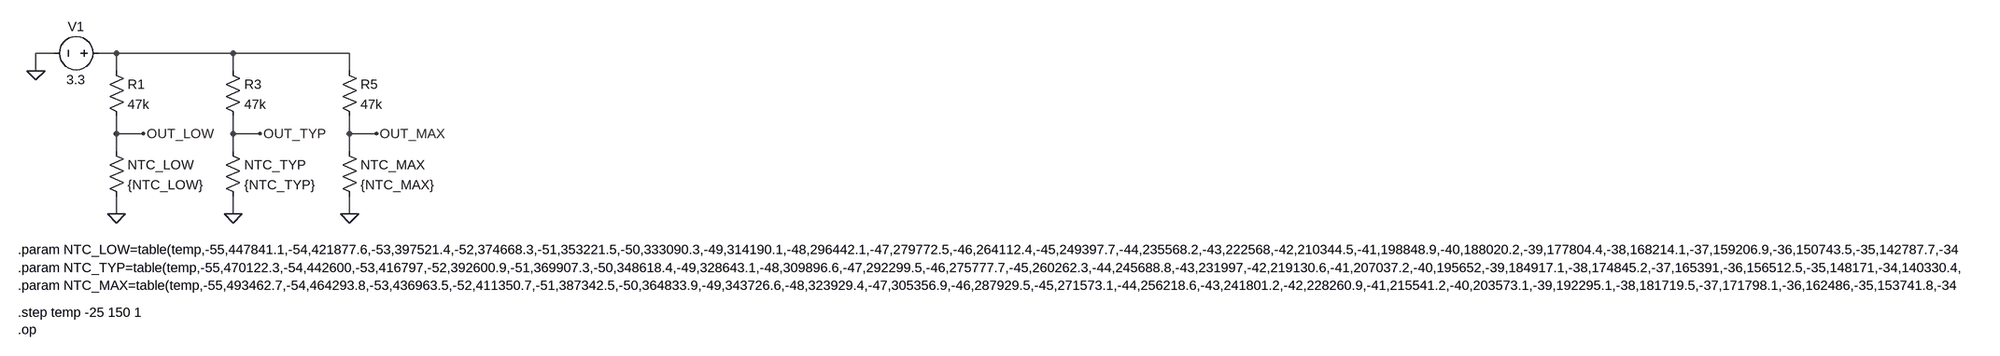
[diagram p0: schematic NTC.asc]
NTC.asc, the LTspice schematic file:
Version 4
SHEET 1 37652 680
WIRE 0 32 -32 32
WIRE 112 32 80 32
WIRE 320 32 112 32
WIRE 528 32 320 32
WIRE -32 64 -32 32
WIRE 112 64 112 32
WIRE 320 64 320 32
WIRE 528 64 528 32
WIRE 112 176 112 144
WIRE 160 176 112 176
WIRE 320 176 320 144
WIRE 368 176 320 176
WIRE 528 176 528 144
WIRE 576 176 528 176
WIRE 112 208 112 176
WIRE 320 208 320 176
WIRE 528 208 528 176
WIRE 112 320 112 288
WIRE 320 320 320 288
WIRE 528 320 528 288
FLAG 112 320 0
FLAG -32 64 0
FLAG 160 176 OUT_LOW
FLAG 320 320 0
FLAG 368 176 OUT_TYP
FLAG 528 320 0
FLAG 576 176 OUT_MAX
SYMBOL res 96 48 R0
SYMATTR InstName R1
SYMATTR Value 47k
SYMBOL res 96 192 R0
SYMATTR InstName NTC_LOW
SYMATTR Value {NTC_LOW}
SYMBOL voltage 96 32 R90
WINDOW 0 -32 56 VBottom 2
WINDOW 3 32 56 VTop 2
WINDOW 123 0 0 Left 0
WINDOW 39 0 0 Left 0
SYMATTR InstName V1
SYMATTR Value 3.3
SYMBOL res 304 48 R0
SYMATTR InstName R3
SYMATTR Value 47k
SYMBOL res 304 192 R0
SYMATTR InstName NTC_TYP
SYMATTR Value {NTC_TYP}
SYMBOL res 512 48 R0
SYMATTR InstName R5
SYMATTR Value 47k
SYMBOL res 512 192 R0
SYMATTR InstName NTC_MAX
SYMATTR Value {NTC_MAX}
TEXT -64 496 Left 2 !.step temp -25 150 1\n.op
TEXT -64 384 Left 2 !.param NTC_LOW=table(temp,-55,447841.1,-54,421877.6,-53,397521.4,-52,374668.3,-51,353221.5,-50,333090.3,-49,314190.1,-48,296442.1,-47,279772.5,-46,264112.4,-45,249397.7,-44,235568.2,-43,222568,-42,210344.5,-41,198848.9,-40,188020.2,-39,177804.4,-38,168214.1,-37,159206.9,-36,150743.5,-35,142787.7,-34,135305.5,-33,128265.9,-32,121639.7,-31,115400.1,-30,109522.1,-29,103989.4,-28,98772.5,-27,93851.2,-26,89207.1,-25,84822.7,-24,80681.9,-23,76769.8,-22,73072.2,-21,69576.1,-20,66269.4,-19,63147.7,-18,60192.3,-17,57393.3,-16,54741.5,-15,52228.3,-14,49845.6,-13,47585.9,-12,45442.2,-11,43407.8,-10,41476.5,-9,39634.5,-8,37885.5,-7,36224.4,-6,34646.1,-5,33146.2,-4,31720.2,-3,30364.1,-2,29074,-1,27846.5,0,26678,1,25569,2,24512.3,3,23505.2,4,22545,5,21629.4,6,20756,7,19922.7,8,19127.3,9,18368,10,17643,11,16949.4,12,16287,13,15654.1,14,15049.3,15,14471.2,16,13918.4,17,13389.8,18,12884.1,19,12400.2,20,11937.1,21,11494.5,22,11070.3,23,10663.7,24,10273.8,25,9900,26,9534.3,27,9183.8,28,8847.7,29,8525.4,30,8216.2,31,7920.4,32,7636.7,33,7364.7,34,7103.8,35,6853.4,36,6613.1,37,6382.5,38,6161.1,39,5948.5,40,5744.3,41,5547.4,42,5358.2,43,5176.4,44,5001.5,45,4833.3,46,4671.5,47,4515.9,48,4366.1,49,4222,50,4083.3,51,3949.8,52,3821.3,53,3697.5,54,3578.3,55,3463.4,56,3352.7,57,3246.1,58,3143.2,59,3044.1,60,2948.6,61,2857.8,62,2770.3,63,2685.8,64,2604.4,65,2525.9,66,2450.1,67,2377,68,2306.4,69,2238.2,70,2172.4,71,2108.6,72,2046.9,73,1987.3,74,1929.8,75,1874.1,76,1820.4,77,1768.4,78,1718.1,79,1669.5,80,1622.5,81,1577.2,82,1533.4,83,1490.9,84,1449.9,85,1410.1,86,1371.7,87,1334.4,88,1298.4,89,1263.5,90,1229.6,91,1196.6,92,1164.7,93,1133.7,94,1103.7,95,1074.6,96,1046.4,97,1019,98,992.5,99,966.8,100,941.9,101,917.9,102,894.6,103,872,104,850.1,105,828.8,106,808.1,107,788.1,108,768.6,109,749.7,110,731.3,111,713.5,112,696.2,113,679.3,114,663,115,647.1,116,631.6,117,616.6,118,602,119,587.8,120,574,121,560.6,122,547.6,123,534.9,124,522.6,125,510.6,126,499,127,487.6,128,476.6,129,465.8,130,455.4,131,445.2,132,435.2,133,425.6,134,416.2,135,407,136,398.1,137,389.4,138,381,139,372.7,140,364.7,141,356.9,142,349.3,143,341.9,144,334.7,145,327.6,146,320.8,147,314.1,148,307.6,149,301.2,150,295)
TEXT -64 416 Left 2 !.param NTC_TYP=table(temp,-55,470122.3,-54,442600,-53,416797,-52,392600.9,-51,369907.3,-50,348618.4,-49,328643.1,-48,309896.6,-47,292299.5,-46,275777.7,-45,260262.3,-44,245688.8,-43,231997,-42,219130.6,-41,207037.2,-40,195652,-39,184917.1,-38,174845.2,-37,165391,-36,156512.5,-35,148171,-34,140330.4,-33,132957.6,-32,126021.5,-31,119493.6,-30,113347.1,-29,107564.9,-28,102115.5,-27,96977.6,-26,92131.5,-25,87558.8,-24,83242.4,-23,79166.3,-22,75315.7,-21,71676.8,-20,68236.7,-19,64990.7,-18,61919,-17,59011.3,-16,56257.9,-15,53649.6,-14,51177.9,-13,48834.9,-12,46613.2,-11,44505.8,-10,42506.2,-9,40599.7,-8,38790.5,-7,37072.9,-6,35441.7,-5,33892.2,-4,32419.7,-3,31020,-2,29689,-1,28423.1,0,27218.6,1,26076,2,24987.7,3,23950.9,4,22962.9,5,22021.1,6,21123,7,20266.6,8,19449.5,9,18669.8,10,17925.5,11,17213.9,12,16534.4,13,15885.6,14,15265.8,15,14673.5,16,14107.5,17,13566.4,18,13048.9,19,12554,20,12080.5,21,11628.1,22,11194.7,23,10779.5,24,10381.5,25,10000,26,9634.2,27,9283.5,28,8947,29,8624.2,30,8314.5,31,8018.1,32,7733.7,33,7460.9,34,7199.1,35,6947.9,36,6706.7,37,6475.1,38,6252.6,39,6039,40,5833.6,41,5635.7,42,5445.4,43,5262.3,44,5086.3,45,4916.9,46,4753.9,47,4597.1,48,4446.1,49,4300.8,50,4160.9,51,4026.2,52,3896.4,53,3771.4,54,3651,55,3535,56,3423.1,57,3315.2,58,3211.3,59,3111,60,3014.3,61,2922.4,62,2833.7,63,2748.2,64,2665.7,65,2586.1,66,2509.3,67,2435.1,68,2363.5,69,2294.3,70,2227.5,71,2162.7,72,2100.1,73,2039.6,74,1981.1,75,1924.5,76,1869.8,77,1817,78,1765.8,79,1716.4,80,1668.5,81,1622.4,82,1577.7,83,1534.5,84,1492.7,85,1452.1,86,1412.9,87,1374.9,88,1338.1,89,1302.5,90,1268,91,1234.3,92,1201.6,93,1170,94,1139.3,95,1109.6,96,1080.7,97,1052.8,98,1025.6,99,999.3,100,973.8,101,949.2,102,925.4,103,902.2,104,879.8,105,858,106,836.8,107,816.2,108,796.3,109,776.9,110,758,111,739.7,112,721.9,113,704.6,114,687.8,115,671.5,116,655.6,117,640.2,118,625.2,119,610.6,120,596.4,121,582.6,122,569.2,123,556.2,124,543.5,125,531.1,126,519.1,127,507.4,128,496.1,129,485,130,474.2,131,463.7,132,453.5,133,443.5,134,433.8,135,424.3,136,415.1,137,406.2,138,397.4,139,388.9,140,380.7,141,372.6,142,364.7,143,357.1,144,349.6,145,342.3,146,335.2,147,328.3,148,321.5,149,315,150,308.5)
TEXT -64 448 Left 2 !.param NTC_MAX=table(temp,-55,493462.7,-54,464293.8,-53,436963.5,-52,411350.7,-51,387342.5,-50,364833.9,-49,343726.6,-48,323929.4,-47,305356.9,-46,287929.5,-45,271573.1,-44,256218.6,-43,241801.2,-42,228260.9,-41,215541.2,-40,203573.1,-39,192295.1,-38,181719.5,-37,171798.1,-36,162486,-35,153741.8,-34,145527.4,-33,137807.1,-32,130548.1,-31,123719.8,-30,117294,-29,111252.2,-28,105561.1,-27,100198.1,-26,95142.3,-25,90374.1,-24,85875.5,-23,81629.5,-22,77620.4,-21,73833.6,-20,70255.4,-19,66880.7,-18,63688.9,-17,60668.9,-16,57810.5,-15,55104,-14,52540.6,-13,50111.7,-12,47809.7,-11,45627.1,-10,43557,-9,41584.3,-8,39713.1,-7,37937.4,-6,36251.9,-5,34651.5,-4,33131.3,-3,31686.9,-2,30314,-1,29008.8,0,27767.5,1,26590.4,2,25469.8,3,24402.6,4,23386.1,5,22417.5,6,21494.4,7,20614.3,8,19775.1,9,18974.5,10,18210.7,11,17480.7,12,16784,13,16118.9,14,15483.8,15,14877.2,16,14297.7,17,13743.9,18,13214.5,19,12708.4,20,12224.4,21,11762.1,22,11319.5,23,10895.5,24,10489.2,25,10100,26,9734.2,27,9383.3,28,9046.5,29,8723.4,30,8413.2,31,8116.2,32,7831.2,33,7557.6,34,7295.1,35,7043,36,6800.9,37,6568.3,38,6344.9,39,6130.2,40,5923.8,41,5724.8,42,5533.3,43,5349.2,44,5172,45,5001.5,46,4837.3,47,4679.3,48,4527.1,49,4380.6,50,4239.5,51,4103.6,52,3972.7,53,3846.5,54,3724.9,55,3607.6,56,3494.6,57,3385.6,58,3280.4,59,3179,60,3081.2,61,2988.1,62,2898.4,63,2811.8,64,2728.2,65,2647.6,66,2569.7,67,2494.5,68,2421.8,69,2351.7,70,2283.9,71,2218.1,72,2154.5,73,2093,74,2033.5,75,1976.1,76,1920.5,77,1866.7,78,1814.7,79,1764.4,80,1715.7,81,1668.7,82,1623.2,83,1579.2,84,1536.5,85,1495.2,86,1455.2,87,1416.5,88,1379,89,1342.6,90,1307.4,91,1273,92,1239.6,93,1207.3,94,1176,95,1145.6,96,1116.1,97,1087.5,98,1059.8,99,1032.8,100,1006.7,101,981.6,102,957.1,103,933.4,104,910.4,105,888.1,106,866.4,107,845.3,108,824.8,109,804.9,110,785.6,111,766.8,112,748.5,113,730.8,114,713.5,115,696.8,116,680.5,117,664.6,118,649.2,119,634.2,120,619.6,121,605.4,122,591.6,123,578.2,124,565.1,125,552.4,126,540.1,127,528,128,516.3,129,504.9,130,493.8,131,482.9,132,472.4,133,462.1,134,452.1,135,442.3,136,432.8,137,423.6,138,414.6,139,405.8,140,397.2,141,388.9,142,380.8,143,372.9,144,365.1,145,357.6,146,350.3,147,343.1,148,336.1,149,329.3,150,322.7)

The netlist it stands for:
* NTC.asc
R1 N001 OUT_LOW 47k
R§NTC_LOW OUT_LOW 0 {NTC_LOW}
V1 N001 0 3.3
R3 N001 OUT_TYP 47k
R§NTC_TYP OUT_TYP 0 {NTC_TYP}
R5 N001 OUT_MAX 47k
R§NTC_MAX OUT_MAX 0 {NTC_MAX}
.step temp -25 150 1
.op
.param NTC_LOW=table(temp,-55,447841.1,-54,421877.6,-53,397521.4,-52,374668.3,-51,353221.5,-50,333090.3,-49,314190.1,-48,296442.1,-47,279772.5,-46,264112.4,-45,249397.7,-44,235568.2,-43,222568,-42,210344.5,-41,198848.9,-40,188020.2,-39,177804.4,-38,168214.1,-37,159206.9,-36,150743.5,-35,142787.7,-34,135305.5,-33,128265.9,-32,121639.7,-31,115400.1,-30,109522.1,-29,103989.4,-28,98772.5,-27,93851.2,-26,89207.1,-25,84822.7,-24,80681.9,-23,76769.8,-22,73072.2,-21,69576.1,-20,66269.4,-19,63147.7,-18,60192.3,-17,57393.3,-16,54741.5,-15,52228.3,-14,49845.6,-13,47585.9,-12,45442.2,-11,43407.8,-10,41476.5,-9,39634.5,-8,37885.5,-7,36224.4,-6,34646.1,-5,33146.2,-4,31720.2,-3,30364.1,-2,29074,-1,27846.5,0,26678,1,25569,2,24512.3,3,23505.2,4,22545,5,21629.4,6,20756,7,19922.7,8,19127.3,9,18368,10,17643,11,16949.4,12,16287,13,15654.1,14,15049.3,15,14471.2,16,13918.4,17,13389.8,18,12884.1,19,12400.2,20,11937.1,21,11494.5,22,11070.3,23,10663.7,24,10273.8,25,9900,26,9534.3,27,9183.8,28,8847.7,29,8525.4,30,8216.2,31,7920.4,32,7636.7,33,7364.7,34,7103.8,35,6853.4,36,6613.1,37,6382.5,38,6161.1,39,5948.5,40,5744.3,41,5547.4,42,5358.2,43,5176.4,44,5001.5,45,4833.3,46,4671.5,47,4515.9,48,4366.1,49,4222,50,4083.3,51,3949.8,52,3821.3,53,3697.5,54,3578.3,55,3463.4,56,3352.7,57,3246.1,58,3143.2,59,3044.1,60,2948.6,61,2857.8,62,2770.3,63,2685.8,64,2604.4,65,2525.9,66,2450.1,67,2377,68,2306.4,69,2238.2,70,2172.4,71,2108.6,72,2046.9,73,1987.3,74,1929.8,75,1874.1,76,1820.4,77,1768.4,78,1718.1,79,1669.5,80,1622.5,81,1577.2,82,1533.4,83,1490.9,84,1449.9,85,1410.1,86,1371.7,87,1334.4,88,1298.4,89,1263.5,90,1229.6,91,1196.6,92,1164.7,93,1133.7,94,1103.7,95,1074.6,96,1046.4,97,1019,98,992.5,99,966.8,100,941.9,101,917.9,102,894.6,103,872,104,850.1,105,828.8,106,808.1,107,788.1,108,768.6,109,749.7,110,731.3,111,713.5,112,696.2,113,679.3,114,663,115,647.1,116,631.6,117,616.6,118,602,119,587.8,120,574,121,560.6,122,547.6,123,534.9,124,522.6,125,510.6,126,499,127,487.6,128,476.6,129,465.8,130,455.4,131,445.2,132,435.2,133,425.6,134,416.2,135,407,136,398.1,137,389.4,138,381,139,372.7,140,364.7,141,356.9,142,349.3,143,341.9,144,334.7,145,327.6,146,320.8,147,314.1,148,307.6,149,301.2,150,295)
.param NTC_TYP=table(temp,-55,470122.3,-54,442600,-53,416797,-52,392600.9,-51,369907.3,-50,348618.4,-49,328643.1,-48,309896.6,-47,292299.5,-46,275777.7,-45,260262.3,-44,245688.8,-43,231997,-42,219130.6,-41,207037.2,-40,195652,-39,184917.1,-38,174845.2,-37,165391,-36,156512.5,-35,148171,-34,140330.4,-33,132957.6,-32,126021.5,-31,119493.6,-30,113347.1,-29,107564.9,-28,102115.5,-27,96977.6,-26,92131.5,-25,87558.8,-24,83242.4,-23,79166.3,-22,75315.7,-21,71676.8,-20,68236.7,-19,64990.7,-18,61919,-17,59011.3,-16,56257.9,-15,53649.6,-14,51177.9,-13,48834.9,-12,46613.2,-11,44505.8,-10,42506.2,-9,40599.7,-8,38790.5,-7,37072.9,-6,35441.7,-5,33892.2,-4,32419.7,-3,31020,-2,29689,-1,28423.1,0,27218.6,1,26076,2,24987.7,3,23950.9,4,22962.9,5,22021.1,6,21123,7,20266.6,8,19449.5,9,18669.8,10,17925.5,11,17213.9,12,16534.4,13,15885.6,14,15265.8,15,14673.5,16,14107.5,17,13566.4,18,13048.9,19,12554,20,12080.5,21,11628.1,22,11194.7,23,10779.5,24,10381.5,25,10000,26,9634.2,27,9283.5,28,8947,29,8624.2,30,8314.5,31,8018.1,32,7733.7,33,7460.9,34,7199.1,35,6947.9,36,6706.7,37,6475.1,38,6252.6,39,6039,40,5833.6,41,5635.7,42,5445.4,43,5262.3,44,5086.3,45,4916.9,46,4753.9,47,4597.1,48,4446.1,49,4300.8,50,4160.9,51,4026.2,52,3896.4,53,3771.4,54,3651,55,3535,56,3423.1,57,3315.2,58,3211.3,59,3111,60,3014.3,61,2922.4,62,2833.7,63,2748.2,64,2665.7,65,2586.1,66,2509.3,67,2435.1,68,2363.5,69,2294.3,70,2227.5,71,2162.7,72,2100.1,73,2039.6,74,1981.1,75,1924.5,76,1869.8,77,1817,78,1765.8,79,1716.4,80,1668.5,81,1622.4,82,1577.7,83,1534.5,84,1492.7,85,1452.1,86,1412.9,87,1374.9,88,1338.1,89,1302.5,90,1268,91,1234.3,92,1201.6,93,1170,94,1139.3,95,1109.6,96,1080.7,97,1052.8,98,1025.6,99,999.3,100,973.8,101,949.2,102,925.4,103,902.2,104,879.8,105,858,106,836.8,107,816.2,108,796.3,109,776.9,110,758,111,739.7,112,721.9,113,704.6,114,687.8,115,671.5,116,655.6,117,640.2,118,625.2,119,610.6,120,596.4,121,582.6,122,569.2,123,556.2,124,543.5,125,531.1,126,519.1,127,507.4,128,496.1,129,485,130,474.2,131,463.7,132,453.5,133,443.5,134,433.8,135,424.3,136,415.1,137,406.2,138,397.4,139,388.9,140,380.7,141,372.6,142,364.7,143,357.1,144,349.6,145,342.3,146,335.2,147,328.3,148,321.5,149,315,150,308.5)
.param NTC_MAX=table(temp,-55,493462.7,-54,464293.8,-53,436963.5,-52,411350.7,-51,387342.5,-50,364833.9,-49,343726.6,-48,323929.4,-47,305356.9,-46,287929.5,-45,271573.1,-44,256218.6,-43,241801.2,-42,228260.9,-41,215541.2,-40,203573.1,-39,192295.1,-38,181719.5,-37,171798.1,-36,162486,-35,153741.8,-34,145527.4,-33,137807.1,-32,130548.1,-31,123719.8,-30,117294,-29,111252.2,-28,105561.1,-27,100198.1,-26,95142.3,-25,90374.1,-24,85875.5,-23,81629.5,-22,77620.4,-21,73833.6,-20,70255.4,-19,66880.7,-18,63688.9,-17,60668.9,-16,57810.5,-15,55104,-14,52540.6,-13,50111.7,-12,47809.7,-11,45627.1,-10,43557,-9,41584.3,-8,39713.1,-7,37937.4,-6,36251.9,-5,34651.5,-4,33131.3,-3,31686.9,-2,30314,-1,29008.8,0,27767.5,1,26590.4,2,25469.8,3,24402.6,4,23386.1,5,22417.5,6,21494.4,7,20614.3,8,19775.1,9,18974.5,10,18210.7,11,17480.7,12,16784,13,16118.9,14,15483.8,15,14877.2,16,14297.7,17,13743.9,18,13214.5,19,12708.4,20,12224.4,21,11762.1,22,11319.5,23,10895.5,24,10489.2,25,10100,26,9734.2,27,9383.3,28,9046.5,29,8723.4,30,8413.2,31,8116.2,32,7831.2,33,7557.6,34,7295.1,35,7043,36,6800.9,37,6568.3,38,6344.9,39,6130.2,40,5923.8,41,5724.8,42,5533.3,43,5349.2,44,5172,45,5001.5,46,4837.3,47,4679.3,48,4527.1,49,4380.6,50,4239.5,51,4103.6,52,3972.7,53,3846.5,54,3724.9,55,3607.6,56,3494.6,57,3385.6,58,3280.4,59,3179,60,3081.2,61,2988.1,62,2898.4,63,2811.8,64,2728.2,65,2647.6,66,2569.7,67,2494.5,68,2421.8,69,2351.7,70,2283.9,71,2218.1,72,2154.5,73,2093,74,2033.5,75,1976.1,76,1920.5,77,1866.7,78,1814.7,79,1764.4,80,1715.7,81,1668.7,82,1623.2,83,1579.2,84,1536.5,85,1495.2,86,1455.2,87,1416.5,88,1379,89,1342.6,90,1307.4,91,1273,92,1239.6,93,1207.3,94,1176,95,1145.6,96,1116.1,97,1087.5,98,1059.8,99,1032.8,100,1006.7,101,981.6,102,957.1,103,933.4,104,910.4,105,888.1,106,866.4,107,845.3,108,824.8,109,804.9,110,785.6,111,766.8,112,748.5,113,730.8,114,713.5,115,696.8,116,680.5,117,664.6,118,649.2,119,634.2,120,619.6,121,605.4,122,591.6,123,578.2,124,565.1,125,552.4,126,540.1,127,528,128,516.3,129,504.9,130,493.8,131,482.9,132,472.4,133,462.1,134,452.1,135,442.3,136,432.8,137,423.6,138,414.6,139,405.8,140,397.2,141,388.9,142,380.8,143,372.9,144,365.1,145,357.6,146,350.3,147,343.1,148,336.1,149,329.3,150,322.7)
.backanno
.end

* Results of the author's LTspice run, read from the files saved beside the schematic
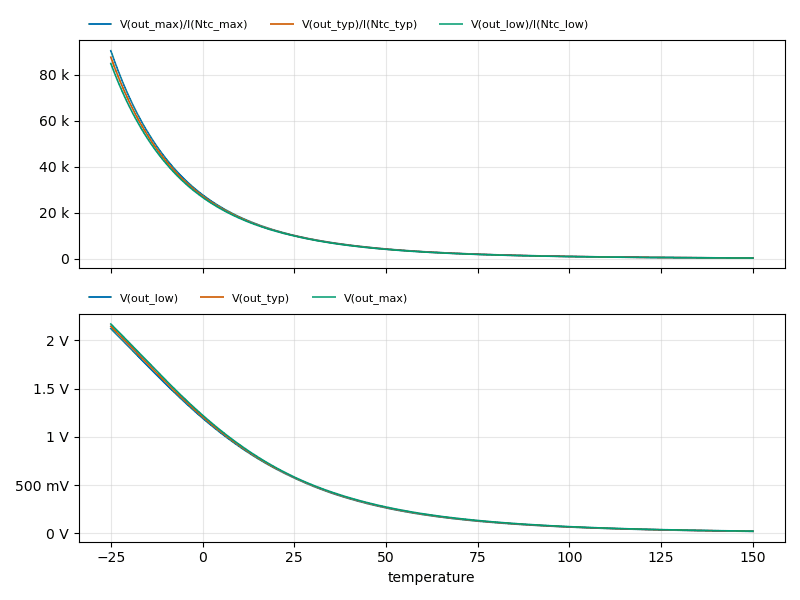
[diagram p1: Operating Point of NTC.asc, plotted from the saved traces]
* Operating Point, 1 run:
*   V(out_max)/I(Ntc_max): 90.37 k at temperature=-25 , 322.7  at temperature=150 , min 322.7 , max 90.37 k
*   V(out_typ)/I(Ntc_typ): 87.56 k at temperature=-25 , 308.5  at temperature=150 , min 308.5 , max 87.56 k
*   V(out_low)/I(Ntc_low): 84.82 k at temperature=-25 , 295  at temperature=150 , min 295 , max 84.82 k
*   V(out_low): 2.123 V at temperature=-25 , 20.58 mV at temperature=150 , min 20.58 mV, max 2.123 V
*   V(out_typ): 2.147 V at temperature=-25 , 21.52 mV at temperature=150 , min 21.52 mV, max 2.147 V
*   V(out_max): 2.171 V at temperature=-25 , 22.5 mV at temperature=150 , min 22.5 mV, max 2.171 V